# Altium project ESP32_Projet.PrjPcb
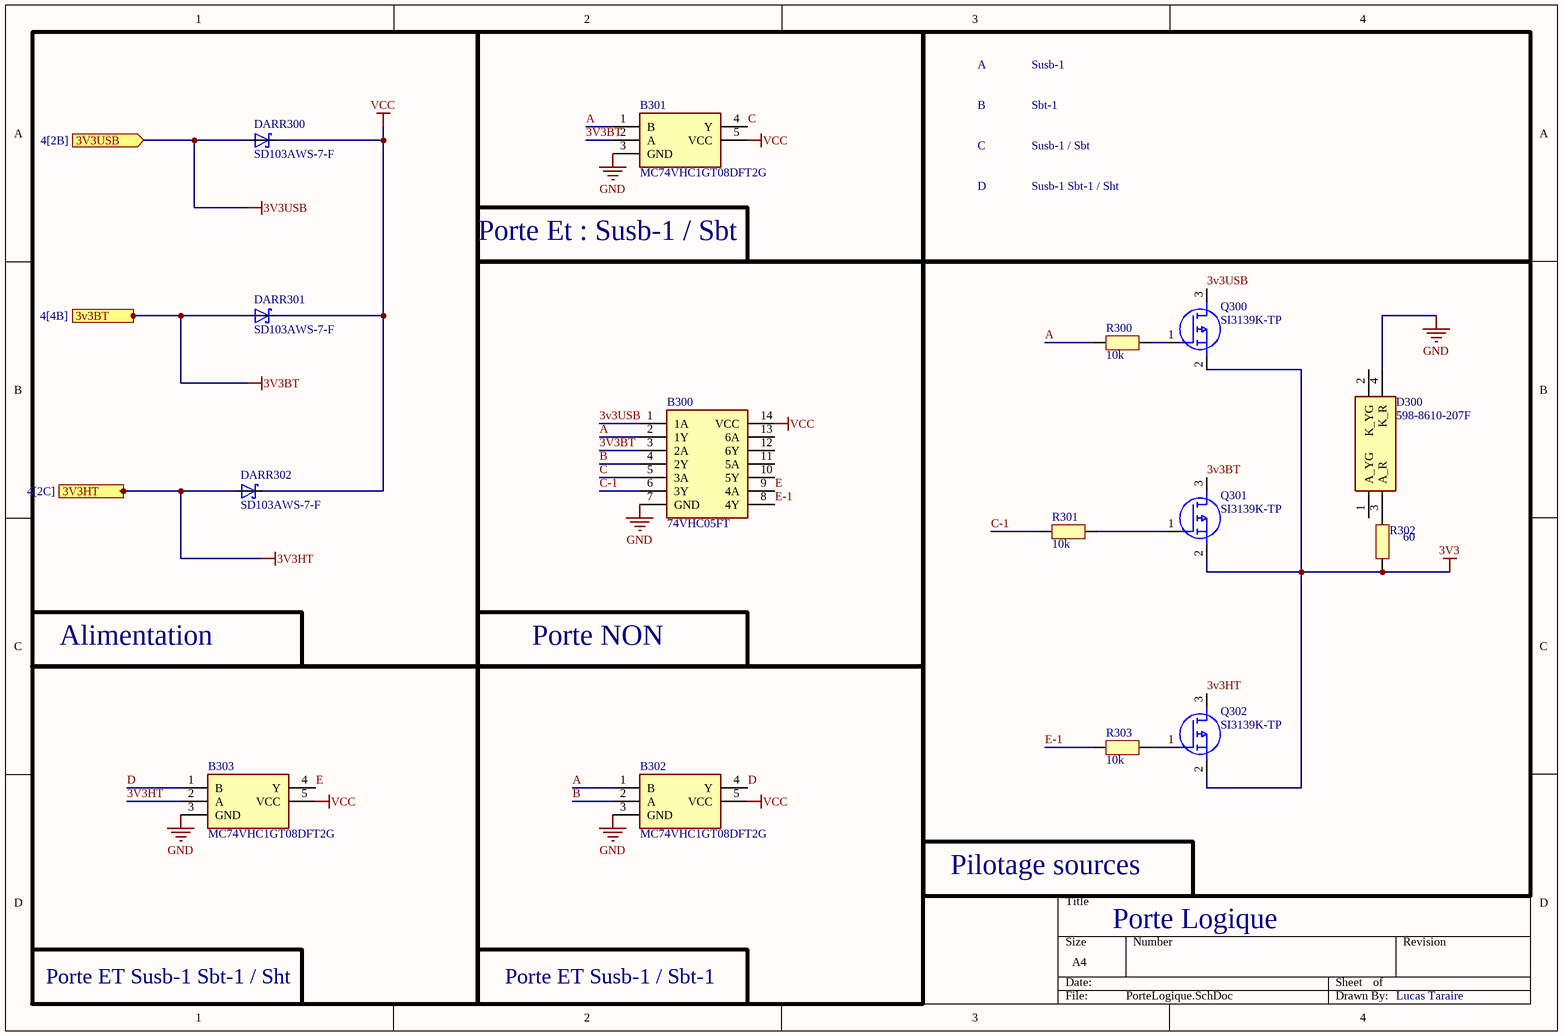
[diagram p0: PorteLogique.SchDoc]
7 sheets, 82 parts. Net scope: flat (ports and power ports of the same name join across sheets).
Board file: PCB1.PcbDoc
Sheets:
  PorteLogique.SchDoc
  IHM.SchDoc
  Extensibilite.SchDoc
  MCU et Communication.SchDoc
  Mesure.SchDoc
  Alimentation.SchDoc
  Sources.SchDoc

## Sheet PorteLogique.SchDoc: Porte Logique
size A4; Date: 25/11/2024; Author: Lucas Taraire; DrawnBy: Lucas Taraire; SheetNumber: 1; SheetTotal: 7

### Parts
B300  74VHC05FT  [SOP65P640X120-14N]
B301  MC74VHC1GT08DFT2G  [SOT65P210X110-5N]
B302  MC74VHC1GT08DFT2G  [SOT65P210X110-5N]
B303  MC74VHC1GT08DFT2G  [SOT65P210X110-5N]
D300  598-8610-207F  [5988610207F]
DARR300  SD103AWS-7-F  [SD103AWS-7-F]
DARR301  SD103AWS-7-F  [SD103AWS-7-F]
DARR302  SD103AWS-7-F  [SD103AWS-7-F]
Q300  SI3139K-TP  [SI3139K-TP]
Q301  SI3139K-TP  [SI3139K-TP]
Q302  SI3139K-TP  [SI3139K-TP]
R300  10k  [RESC1005X06N]
R301  10k  [RESC1005X06N]
R302  60  [RESC1005X06N]
R303  10k  [RESC1005X06N]

### Blocks framed on the sheet
Porte Et : Susb-1 / Sbt: B301
Pilotage sources: D300 Q300-Q302 R300-R303
Alimentation: B303
Porte NON: B302

### Ports
3v3BT (in, see 4[4B]), 3V3HT (in, see 4[2C]), 3V3USB (in, see 4[2B])

### Nets
3V3: Q300.2(S) Q301.2(S) Q302.2(S) R302.1
3V3BT: B300.3(2A) B301.2(A) DARR301.2(A) Q301.3(D) ; port 3v3BT
3V3HT: B303.2(A) DARR302.2(A) Q302.3(D) ; port 3V3HT
3v3USB: B300.1(1A) DARR300.2(A) Q300.3(D) ; port 3V3USB
GND: B300.7(GND) B301.3(GND) B302.3(GND) B303.3(GND) D300.4(K_R)
VCC: B300.14(VCC) B301.5(VCC) B302.5(VCC) B303.5(VCC) DARR300.1(C) DARR301.1(C) DARR302.1(C)
A: B300.2(1Y) B301.1(B) B302.1(B) R300.1
B: B300.4(2Y) B302.2(A)
C: B300.5(3A) B301.4(Y)
C-1: B300.6(3Y) R301.1
D: B302.4(Y) B303.1(B)
E: B300.9(4A) B303.4(Y)
E-1: B300.8(4Y) R303.1
NetQ300_1: Q300.1(G) R300.2
NetQ301_1: Q301.1(G) R301.2
NetQ302_1: Q302.1(G) R303.2

Not connected (* = marked no-connect by the designer): B300 10(5Y) 11(5A) 12(6Y) 13(6A); D300 1(A_YG) 2(K_YG) 3(A_R); R302 2

### Notes on the sheet
- A
- B
- Susb-1
- Sbt-1
- C
- Susb-1 / Sbt
- D
- Susb-1 Sbt-1 / Sht
- Porte ET Susb-1 Sbt-1 / Sht
- Porte ET Susb-1 / Sbt-1

### Library data of the parts
B300 = 74VHC05FT: Logic Gates CMOS LOGIC IC INVERTER; Manufacturer_Name: Toshiba; Manufacturer_Part_Number: 74VHC05FT; Mouser Part Number: 757-74VHC05FT
B301-B303 = MC74VHC1GT08DFT2G: Single 2-Input AND Gate, TTL Level; Manufacturer_Name: onsemi; Manufacturer_Part_Number: MC74VHC1GT08DFT2G; Parameter 3: *
D300 = 598-8610-207F: Standard LEDs - SMD Red/Green WC 80/50mcd 645/570nm; Manufacturer_Name: Dialight; Geometry.Height: 0.8mm; Manufacturer_Part_Number: 598-8610-207F; Mouser Part Number: 645-598-8610-207F; Mouser Price/Stock: https://www.mouser.co.uk/ProductDetail/Dialight/598-8610-207F?qs=7JStj%2FjQ2SFuCjosqwklHQ%3D%3D; Arrow Part Number: 598-8610-207F; Arrow Price/Stock: https://www.arrow.com/en/products/598-8610-207f/dialight?region=nac; Datasheet Link: https://media.digikey.com/pdf/Data%20Sheets/Dialight%20PDFs/598%20Series%201210%20Pkg%20Bi-Color.pdf
DARR300-DARR302 = SD103AWS-7-F: Diode Array 3 Independent Schottky 40V 175mA Surface Mount 6-TSSOP, SC-88, SOT-363
Q300-Q302 = SI3139K-TP: MOSFET P-Channel MOSFET
R300-R303 = Resistor

## Sheet IHM.SchDoc
size A4; SheetNumber: 2; SheetTotal: 7
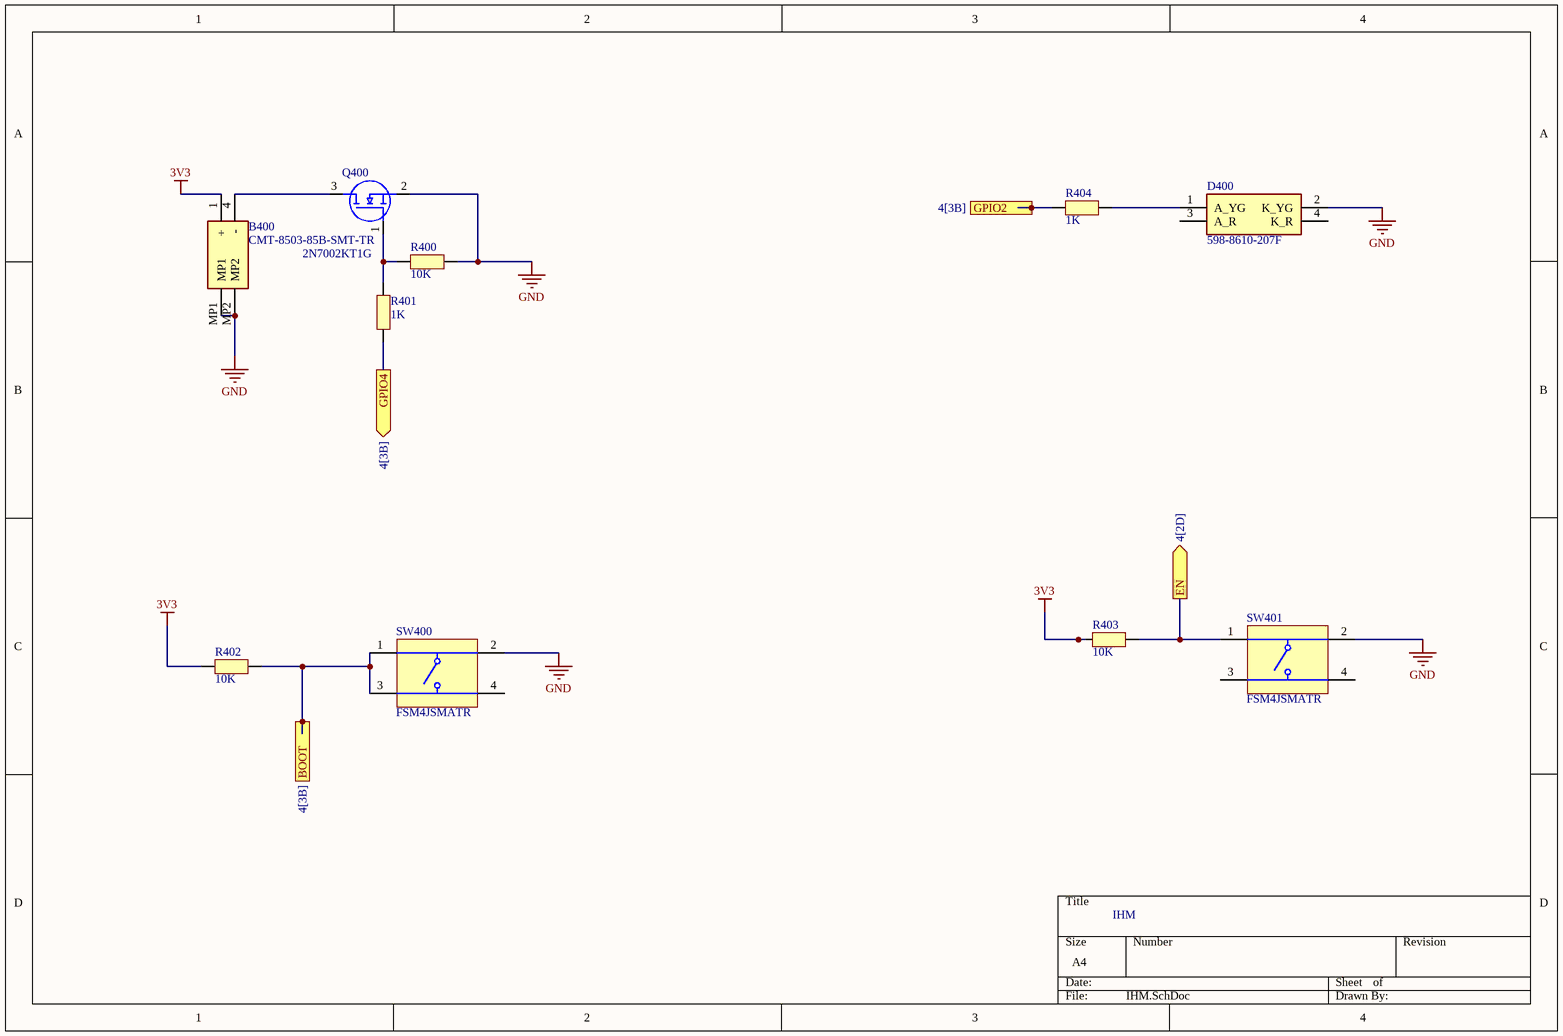
[diagram p1: IHM.SchDoc]

### Parts
B400  CMT-8503-85B-SMT-TR  [CMT850385BSMTTR]
D400  598-8610-207F  [5988610207F]
Q400  2N7002KT1G  [SOT96P237X111-3N]
R400  10K  [RESC1005X06N]
R401  1K  [RESC1005X06N]
R402  10K  [RESC1005X06N]
R403  10K  [RESC1005X06N]
R404  1K  [RESC1005X06N]
SW400  FSM4JSMATR  [TECO-FSM4JSMATR_V]
SW401  FSM4JSMATR  [TECO-FSM4JSMATR_V]

### Ports
BOOT (out, see 4[3B]), EN (out, see 4[2D]), GPIO2 (in, see 4[3B]), GPIO4 (out, see 4[3B])

### Nets
3V3: B400.1(+) R402.2 R403.2
GND: B400.MP1 B400.MP2 D400.2(K_YG) Q400.2(S) R400.2 SW400.2 SW401.2
NetB400_4: B400.4(-) Q400.3(D)
NetD400_1: D400.1(A_YG) R404.1
NetQ400_1: Q400.1(G) R400.1 R401.2
NetR401_1: R401.1 ; port GPIO4
NetR402_1: R402.1 SW400.1 SW400.3 ; port BOOT
NetR403_1: R403.1 SW401.1 ; port EN
NetR404_2: R404.2 ; port GPIO2

Not connected (* = marked no-connect by the designer): D400 3(A_R) 4(K_R); SW400 4; SW401 3 4

### Notes on the sheet
- IHM

### Library data of the parts
B400 = CMT-8503-85B-SMT-TR: Speakers & Transducers buzzer, 8.5 mm, 3 mm deep, M, 3.6 V, 85 dB, Surface Mount (SMT), Audio Transducer; Manufacturer_Name: Same Sky; Manufacturer_Part_Number: CMT-8503-85B-SMT-TR; Mouser Part Number: 490-CMT-850385BSMTTR
D400 = 598-8610-207F: as D300 on sheet PorteLogique; Manufacturer_Part_Number: 598-8610-207F; Mouser Part Number: 645-598-8610-207F; Mouser Price/Stock: https://www.mouser.co.uk/ProductDetail/Dialight/598-8610-207F?qs=7JStj%2FjQ2SFuCjosqwklHQ%3D%3D; Arrow Part Number: 598-8610-207F; Arrow Price/Stock: https://www.arrow.com/en/products/598-8610-207f/dialight?region=nac; Datasheet Link: https://media.digikey.com/pdf/Data%20Sheets/Dialight%20PDFs/598%20Series%201210%20Pkg%20Bi-Color.pdf
Q400 = 2N7002KT1G: MOSFET N-Ch 60V 380mA Small Signal SOT23 ON Semiconductor 2N7002KT1G N-channel MOSFET Transistor, 380 mA, 60 V, 3-Pin SOT-23; Manufacturer_Name: onsemi; Geometry.Height: 1.11mm; Manufacturer_Part_Number: 2N7002KT1G; Mouser Part Number: 863-2N7002KT1G; Mouser Price/Stock: https://www.mouser.co.uk/ProductDetail/onsemi/2N7002KT1G?qs=Jh7l0IbPjifUiTytu%252BGGDQ%3D%3D; Arrow Part Number: 2N7002KT1G; Arrow Price/Stock: https://www.arrow.com/en/products/2n7002kt1g/on-semiconductor?utm_currency=USD&region=nac; Datasheet Link: http://www.onsemi.com/pub/Collateral/2N7002K-D.PDF
R400-R404 = Resistor
SW400 SW401 = CMP-2000-07486-1: Micro Miniature Push Button Switch FSM JSM, 50 mA, -35 to 85 degC, 4-Pin SMD, RoHS, Tape and Reel; Manufacturer: TE Connectivity; Mechanical Life: 100000Cycles; Current Rating: 50mA; Actuator Material: Polyamide; Max Voltage Rating (DC): 12V; Capacitance: 0f; Illumination Type: Illuminated; Voltage Rating (DC): 24V; Case\/Package: SMD/SMT; Operating Force: 160gf; Contact Resistance: 100mOhm; Actuator Length: 0.055inch; Switch Travel: 0.25mm; Throw Configuration: SPST; Termination: GullWing; Contact Plating: Silver; Orientation: Straight; Mounting Technology: SurfaceMount; REACH SVHC: Unknown; Electrical Life: 100000Cycles; Package Reference: FSM4JSMATR; Max Operating Temperature: 85degC; Manufacturer URL: http://www.te.com/; Package Description: 4-Pin Surface Mount Device, Body 6 x 6 mm, Pitch 4.5 mm; Datasheet Version: Rev. V, 02/2015; Packaging: TapeandReel; Min Operating Temperature: -35degC; Mount: SurfaceMount; Contact Current Rating: 50mA; Contact Material: CopperAlloy; Package Quantity: 1200; Datasheet URL: http://www.te.com/commerce/DocumentDelivery/DDEController?Action=showdoc&DocId=Customer+Drawing%7F2-1437565-7%7FV%7Fpdf%7FEnglish%7FENG_CD_2-1437565-7_V.pdf%7F4-1437565-2; RoHSCompliant: true

## Sheet Extensibilite.SchDoc: EXTENSIBILITE
size A4; Date: 28/11/2024; Author: NOUBIGA Thierry; SheetNumber: 3; SheetTotal: 7; Time: 14h33
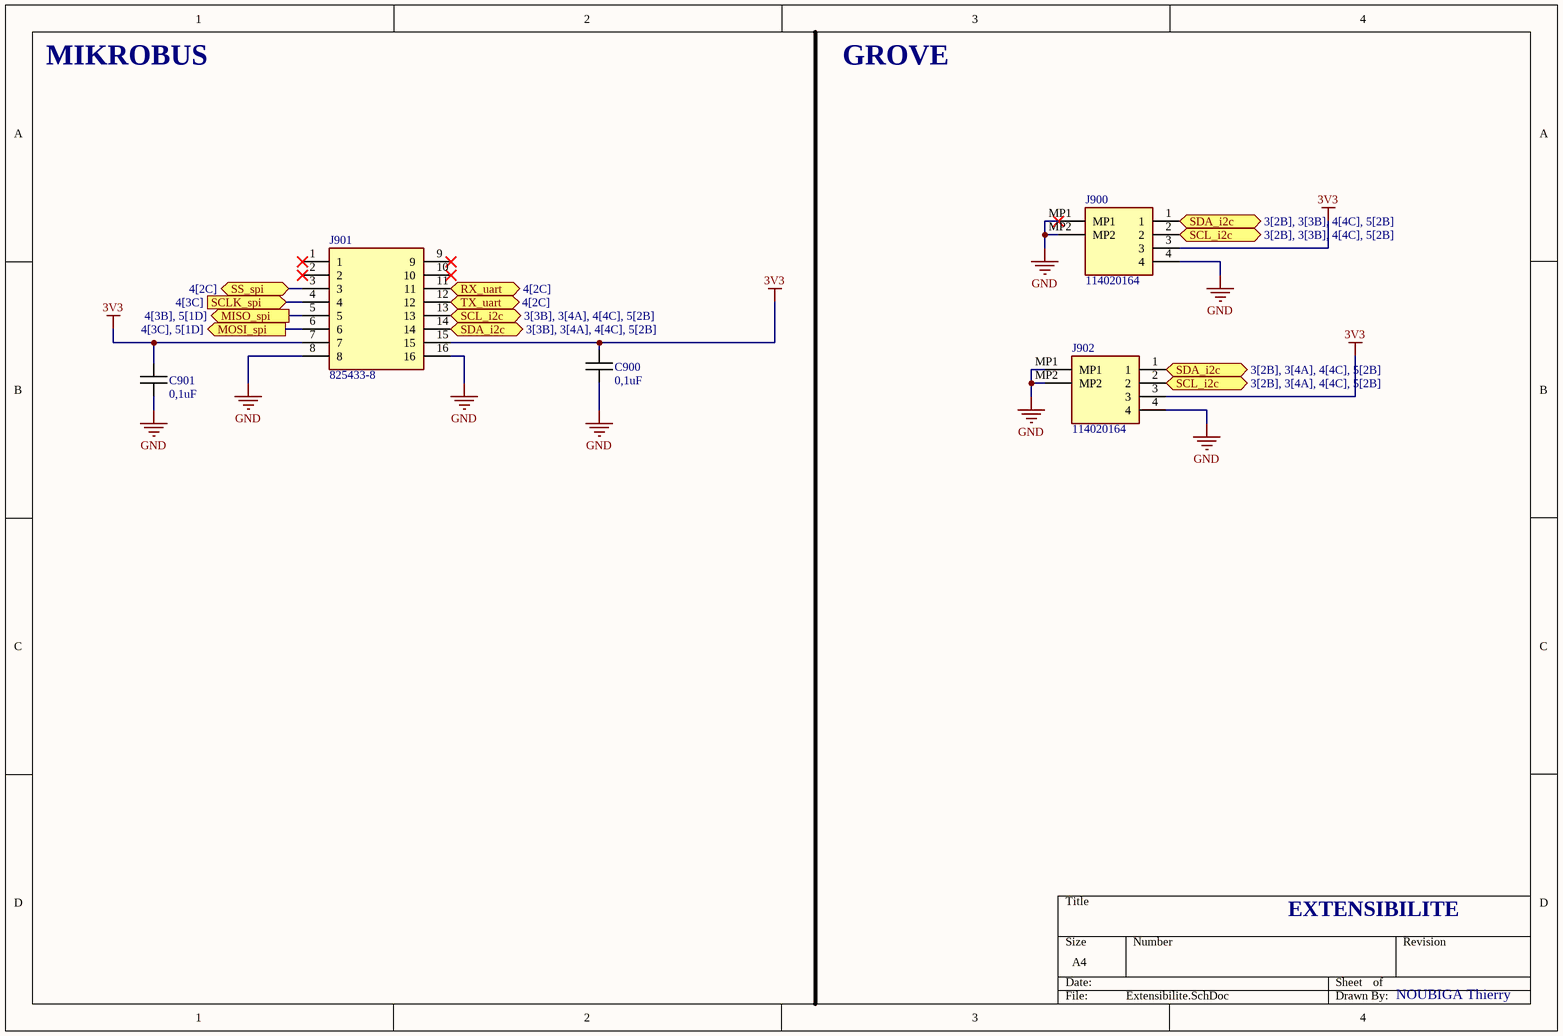
[diagram p2: Extensibilite.SchDoc]

### Parts
C900  0,1uF  [CAPC1005X06N]
C901  0,1uF  [CAPC1005X06N]
J900  114020164  [114020164]
J901  825433-8  [Connect-Mikronus]
J902  114020164  [114020164]

### Ports
MISO_spi (out, see 4[3B], 5[1D]), MOSI_spi (out, see 4[3C], 5[1D]), RX_uart (bidir, see 4[2C]), SCL_i2c (bidir, see 3[2B], 3[3B], 4[4C], 5[2B]), SCL_i2c (bidir, see 3[2B], 3[4A], 4[4C], 5[2B]), SCL_i2c (bidir, see 3[3B], 3[4A], 4[4C], 5[2B]), SCLK_spi (in, see 4[3C]), SDA_i2c (bidir, see 3[2B], 3[3B], 4[4C], 5[2B]), SDA_i2c (bidir, see 3[2B], 3[4A], 4[4C], 5[2B]), SDA_i2c (bidir, see 3[3B], 3[4A], 4[4C], 5[2B]), SS_spi (bidir, see 4[2C]), TX_uart (bidir, see 4[2C])

### Nets
3V3: C900.1 C901.1 J900.3 J901.7 J901.15 J902.3
GND: C900.2 C901.2 J900.4 J900.MP1 J900.MP2 J901.8 J901.16 J902.4 J902.MP1 J902.MP2
NetB500_4: J900.1 J901.14 J902.1 ; port SDA_i2c
NetB500_5: J900.2 J901.13 J902.2 ; port SCL_i2c
NetB501_3: J901.5 ; port MISO_spi
NetJ901_3: J901.3 ; port SS_spi
NetJ901_4: J901.4 ; port SCLK_spi
NetJ901_6: J901.6 ; port MOSI_spi
NetJ901_11: J901.11 ; port RX_uart
NetJ901_12: J901.12 ; port TX_uart

Not connected (* = marked no-connect by the designer): J901 1* 2* 9* 10*

### Notes on the sheet
- MIKROBUS
- GROVE
- EXTENSIBILITE
- NOUBIGA Thierry

### Library data of the parts
C900 C901 = Capacitor
J900 J902 = 114020164: Seeed Studio Accessories Grove Female Header - SMD-4P-2.0mm-90D-20Pcs; Manufacturer_Name: Seeed Studio; Manufacturer_Part_Number: 114020164; Mouser Part Number: 713-114020164
J901 = Connect-Mikronus: Headers & Wire Housings 8P double for connection mikrobus; Manufacturer_Name: TE Connectivity; Manufacturer_Part_Number: 825433-8; Mouser Part Number: 571-825433-8

## Sheet MCU et Communication.SchDoc: COMMUNICATION BLUETOOTH ET MCU
size A4; Date: 28/11/2024; DrawnBy: NOUBIGA Thierry; DocumentNumber: 1; Revision: V1.0 Rev A; SheetNumber: 4; SheetTotal: 7; Time: 14H55
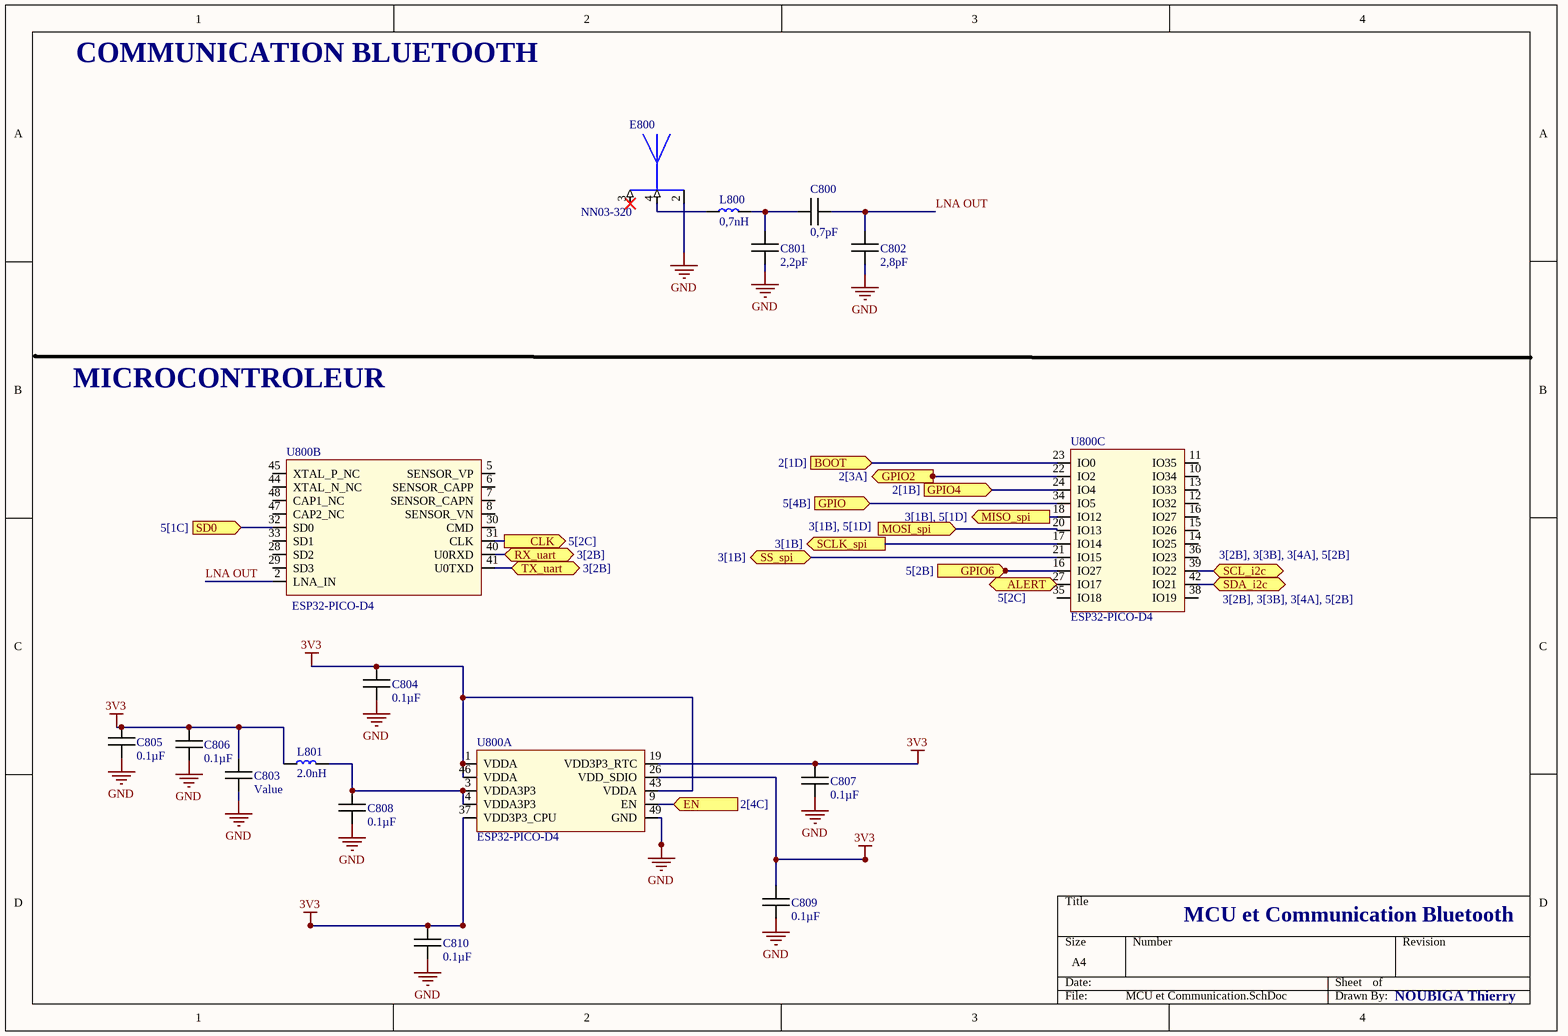
[diagram p3: MCU et Communication.SchDoc]

### Parts
C800  0,7pF  [CAPC1005X06N]
C801  2,2pF  [CAPC1005X06N]
C802  2,8pF  [CAPC1005X06N]
C803  Value  [CAPC1005X06N]
C804  0.1µF  [CAPC1005X06N]
C805  0.1µF  [CAPC1005X06N]
C806  0.1µF  [CAPC1005X06N]
C807  0.1µF  [CAPC1005X06N]
C808  0.1µF  [CAPC1005X06N]
C809  0.1µF  [CAPC1005X06N]
C810  0.1µF  [CAPC1005X06N]
E800  NN03-320  [XCVR_NN03-320]
L800  0,7nH  [LQPC1005X06N]
L801  2.0nH  [LQPC1005X06N]
U800  ESP32-PICO-D4  [PQFN50P700X700X104_HS-49N]  (parts A,B,C of 3)

### Ports
ALERT (bidir, see 5[2C]), BOOT (in, see 2[1D]), CLK (out, see 5[2C]), EN (in, see 2[4C]), GPIO2 (out, see 2[3A]), GPIO4 (in, see 2[1B]), GPIO6 (in, see 5[2B]), GPIO (in, see 5[4B]), MISO_spi (out, see 3[1B], 5[1D]), MOSI_spi (in, see 3[1B], 5[1D]), RX_uart (bidir, see 3[2B]), SCL_i2c (bidir, see 3[2B], 3[3B], 3[4A], 5[2B]), SCLK_spi (out, see 3[1B]), SD0 (in, see 5[1C]), SDA_i2c (bidir, see 3[2B], 3[3B], 3[4A], 5[2B]), SS_spi (bidir, see 3[1B]), TX_uart (bidir, see 3[2B])

### Nets
3V3: C803.1 C804.2 C805.2 C806.2 C807.1 C809.2 C810.1 L801.1 U800.1(VDDA) U800.19(VDD3P3_RTC) U800.26(VDD_SDIO) U800.37(VDD3P3_CPU) U800.43(VDDA) U800.46(VDDA)
GND: C801.2 C802.2 C803.2 C804.1 C805.1 C806.1 C807.2 C808.1 C809.1 C810.2 E800.2(GROUND) U800.49(GND)
LNA OUT: C800.2 C802.1 U800.2(LNA_IN)
NetB500_3: U800.16(IO27) ; port GPIO6
NetB500_4: U800.42(IO21) ; port SDA_i2c
NetB500_5: U800.39(IO22) ; port SCL_i2c
NetB501_1: U800.32(SD0) ; port SD0
NetB501_3: U800.18(IO12) ; port MISO_spi
NetB501_4: U800.31(CLK) ; port CLK
NetB501_5: U800.27(IO17) ; port ALERT
NetB502_2: U800.34(IO5) ; port GPIO
NetC800_1: C800.1 C801.1 L800.2
NetC808_2: C808.2 L801.2 U800.3(VDDA3P3) U800.4(VDDA3P3)
NetE800_4: E800.4(FEED_GNSS) L800.1
NetJ901_3: U800.21(IO15) ; port SS_spi
NetJ901_4: U800.17(IO14) ; port SCLK_spi
NetJ901_6: U800.20(IO13) ; port MOSI_spi
NetJ901_11: U800.40(U0RXD) ; port RX_uart
NetJ901_12: U800.41(U0TXD) ; port TX_uart
NetR401_1: U800.24(IO4) ; port GPIO4
NetR402_1: U800.23(IO0) ; port BOOT
NetR403_1: U800.9(EN) ; port EN
NetR404_2: U800.22(IO2) ; port GPIO2

Not connected (* = marked no-connect by the designer): E800 3(FEED_BLUETOOTH)*; U800 5(SENSOR_VP) 6(SENSOR_CAPP) 7(SENSOR_CAPN) 8(SENSOR_VN) 10(IO34) 11(IO35) 12(IO32) 13(IO33) 14(IO25) 15(IO26) 28(SD2) 29(SD3) 30(CMD) 33(SD1) 35(IO18) 36(IO23) 38(IO19) 44(XTAL_N_NC) 45(XTAL_P_NC) 47(CAP2_NC) 48(CAP1_NC)

### Notes on the sheet
- COMMUNICATION BLUETOOTH
- MICROCONTROLEUR
- MCU et Communication Bluetooth
- NOUBIGA Thierry

### Library data of the parts
C800-C810 = Capacitor
E800 = NN03-320: Dual port antenna booster for GNSS, Bluetooth, 5G and UWB (1561 - 1606MHz, 2400 - 2500MHz, 3400 - 3800MHz, 3100 - 4800MHz and 6000 - 10600 MHz), signal booster; Manufacturer_Name: Ignion; Manufacturer_Part_Number: NN03-320; Mouser Part Number: 128-NN03-320
L800 L801 = Bobine
U800 = ESP32: Système RF sur puce - SoC SIP module ESP32 with 4MByte Flash, Dual Core MCU, Wi-Fi & Bluetooth Combo, LGA48-pin, 7*7mm; Manufacturer 1: Espressif Systems; Supplier 1: Digi-Key; Supplier Part Number 1: 1904-1029-1-ND; Manufacturer Part Number 1: ESP32-PICO-D4

## Sheet Mesure.SchDoc
size A4; SheetNumber: 5; SheetTotal: 7
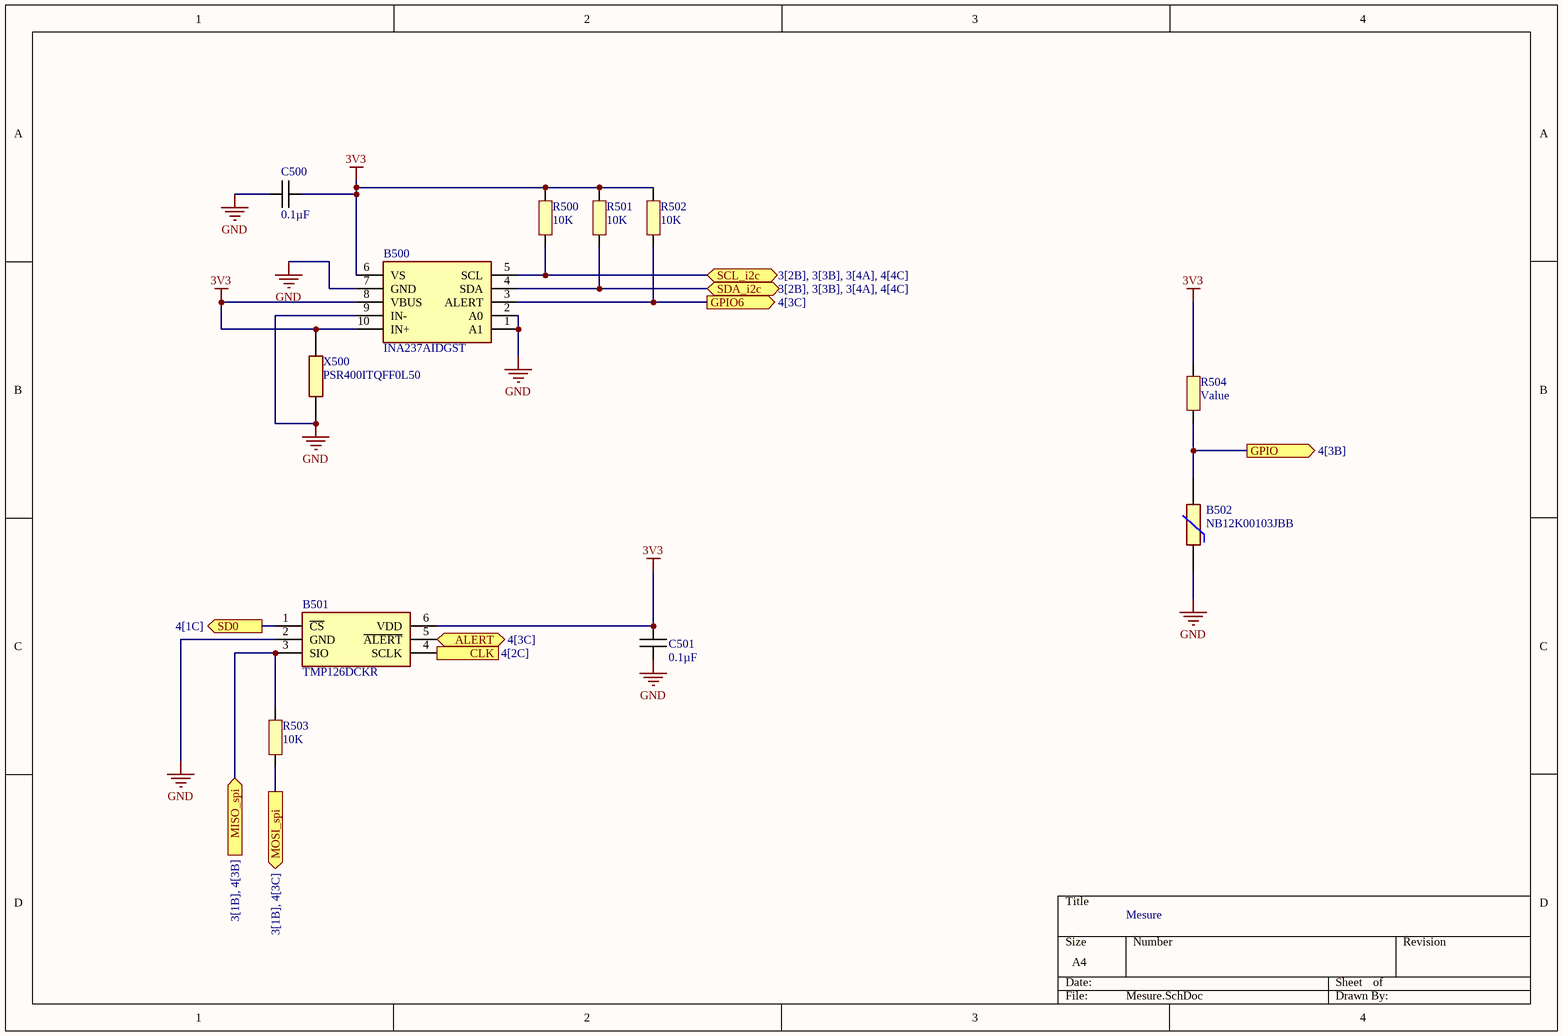
[diagram p4: Mesure.SchDoc]

### Parts
B500  INA237AIDGST  [SOP50P490X110-10N]
B501  TMP126DCKR  [SOT65P210X110-6N]
B502  NB12K00103JBB  [RESC2212X50N]
C500  0.1µF  [CAPC1005X06N]
C501  0.1µF  [CAPC1005X06N]
R500  10K  [RESC1005X06N]
R501  10K  [RESC1005X06N]
R502  10K  [RESC1005X06N]
R503  10K  [RESC1005X06N]
R504  Value  [RESC1005X06N]
X500  PSR400ITQFF0L50  [RESC10052X200N]

### Ports
ALERT (bidir, see 4[3C]), CLK (in, see 4[2C]), GPIO6 (out, see 4[3C]), GPIO (out, see 4[3B]), MISO_spi (in, see 3[1B], 4[3B]), MOSI_spi (out, see 3[1B], 4[3C]), SCL_i2c (bidir, see 3[2B], 3[3B], 3[4A], 4[4C]), SD0 (out, see 4[1C]), SDA_i2c (bidir, see 3[2B], 3[3B], 3[4A], 4[4C])

### Nets
3V3: B500.6(VS) B500.8(VBUS) B500.10(IN+) B501.6(VDD) C500.2 C501.2 R500.2 R501.2 R502.2 R504.1 X500.2
GND: B500.1(A1) B500.2(A0) B500.7(GND) B500.9(IN-) B501.2(GND) B502.1 C500.1 C501.1 X500.1
NetB500_3: B500.3(ALERT) R502.1 ; port GPIO6
NetB500_4: B500.4(SDA) R501.1 ; port SDA_i2c
NetB500_5: B500.5(SCL) R500.1 ; port SCL_i2c
NetB501_1: B501.1(~{CS}) ; port SD0
NetB501_3: B501.3(SIO) R503.1 ; port MISO_spi
NetB501_4: B501.4(SCLK) ; port CLK
NetB501_5: B501.5(~{ALERT}) ; port ALERT
NetB502_2: B502.2 R504.2 ; port GPIO
NetJ901_6: R503.2 ; port MOSI_spi

### Notes on the sheet
- Mesure

### Library data of the parts
B500 = INA237AIDGST: Current Sense Amplifiers 85-V, 16-bit, I2C output current/voltage/power monitor with alert 10-VSSOP -40 to 125; Manufacturer_Name: Texas Instruments; Manufacturer_Part_Number: INA237AIDGST; Mouser Part Number: 595-INA237AIDGST
B501 = TMP126DCKR: Board Mount Temperature Sensors +/-0.25 C SPI temperature sensor with 175 C operation, CRC and slew-rate alert; Manufacturer_Name: Texas Instruments; Manufacturer_Part_Number: TMP126DCKR; Mouser Part Number: 595-TMP126DCKR
B502 = NB12K00103JBB: NTC SMD Thermistor, NB12K, 10K, 5% AVX 10k 0805 Protection NTC Thermistor, 5s, 2 x 1.25 x 1.3mm; Manufacturer_Name: Kyocera AVX; Geometry.Height: 0.5mm; Manufacturer_Part_Number: NB12K00103JBB; Mouser Part Number: 581-NB12K00103JBB; Mouser Price/Stock: https://www.mouser.co.uk/ProductDetail/AVX/NB12K00103JBB/?qs=4%252B6%252BTdINQeDPvI%252BQUQjJ3Q%3D%3D; Arrow Part Number: NB12K00103JBB; Arrow Price/Stock: https://www.arrow.com/en/products/nb12k00103jbb/avx; Datasheet Link: https://datasheet.datasheetarchive.com/originals/distributors/Datasheets-DGA6/551314.pdf
C500 C501 = Capacitor
R500-R504 = Resistor
X500 = PSR400ITQFF0L50: ROHM - PSR400ITQFF0L50 - SMD Current Sense Resistor, 500 ohm, PSR Series, 3921 [1052 Metric], 4 W, +/- 1%, Metal Strip; Manufacturer_Name: ROHM Semiconductor; Geometry.Height: 2mm; Manufacturer_Part_Number: PSR400ITQFF0L50; Mouser Part Number: 755-PSR400ITQFF0L50; Mouser Price/Stock: https://www.mouser.co.uk/ProductDetail/ROHM-Semiconductor/PSR400ITQFF0L50?qs=493kPxzlxfLaT1w5Mo%252BtHg%3D%3D; Arrow Part Number: *; Arrow Price/Stock: *; Datasheet Link: https://componentsearchengine.com/Datasheets/2/PSR400ITQFF0L50.pdf

## Sheet Alimentation.SchDoc
size A4; SheetNumber: 4; SheetTotal: 7
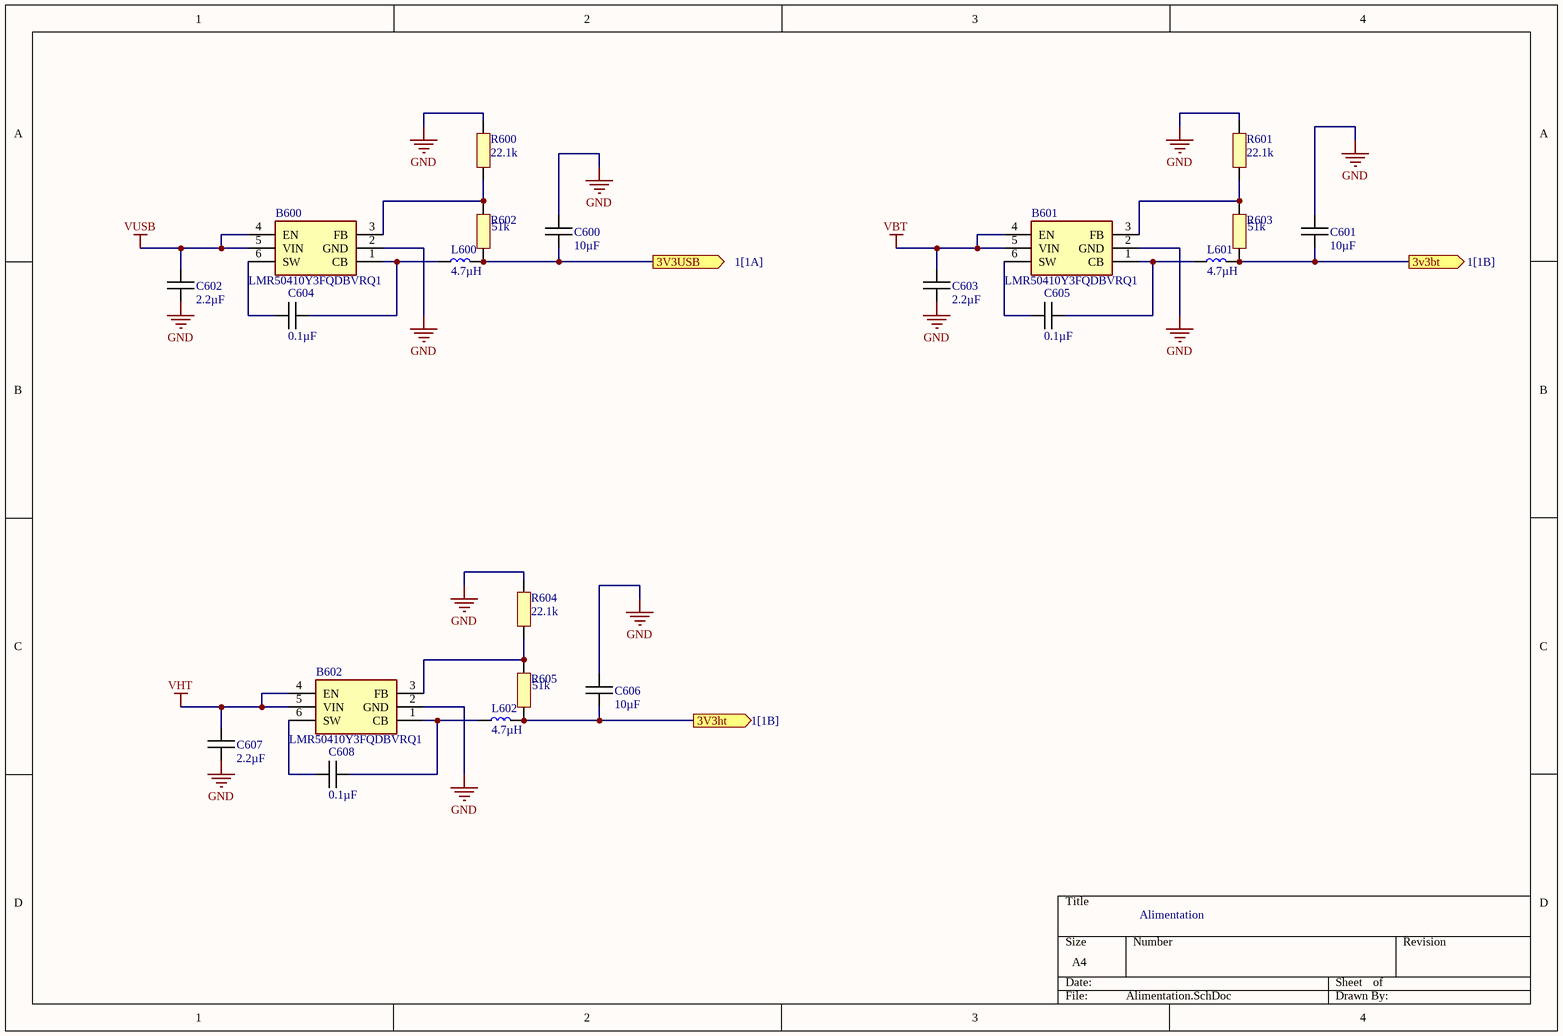
[diagram p5: Alimentation.SchDoc]

### Parts
B600  LMR50410Y3FQDBVRQ1  [SOT95P280X145-6N]
B601  LMR50410Y3FQDBVRQ1  [SOT95P280X145-6N]
B602  LMR50410Y3FQDBVRQ1  [SOT95P280X145-6N]
C600  10µF  [CAPC1005X06N]
C601  10µF  [CAPC1005X06N]
C602  2.2µF  [CAPC1005X06N]
C603  2.2µF  [CAPC1005X06N]
C604  0.1µF  [CAPC1005X06N]
C605  0.1µF  [CAPC1005X06N]
C606  10µF  [CAPC1005X06N]
C607  2.2µF  [CAPC1005X06N]
C608  0.1µF  [CAPC1005X06N]
L600  4.7µH  [LQPC1005X06N]
L601  4.7µH  [LQPC1005X06N]
L602  4.7µH  [LQPC1005X06N]
R600  22.1k  [RESC1005X06N]
R601  22.1k  [RESC1005X06N]
R602  51k  [RESC1005X06N]
R603  51k  [RESC1005X06N]
R604  22.1k  [RESC1005X06N]
R605  51k  [RESC1005X06N]

### Ports
3v3bt (out, see 1[1B]), 3V3ht (out, see 1[1B]), 3V3USB (out, see 1[1A])

### Nets
3V3BT: C601.2 L601.2 R603.1 ; port 3v3bt
3V3HT: C606.2 L602.2 R605.1 ; port 3V3ht
3v3USB: C600.2 L600.2 R602.1 ; port 3V3USB
GND: B600.2(GND) B601.2(GND) B602.2(GND) C600.1 C601.1 C602.2 C603.2 C606.1 C607.2 R600.2 R601.2 R604.2
VBT: B601.4(EN) B601.5(VIN) C603.1
VHT: B602.4(EN) B602.5(VIN) C607.1
VUSB: B600.4(EN) B600.5(VIN) C602.1
NetB600_1: B600.1(CB) C604.1 L600.1
NetB600_3: B600.3(FB) R600.1 R602.2
NetB600_6: B600.6(SW) C604.2
NetB601_1: B601.1(CB) C605.1 L601.1
NetB601_3: B601.3(FB) R601.1 R603.2
NetB601_6: B601.6(SW) C605.2
NetB602_1: B602.1(CB) C608.1 L602.1
NetB602_3: B602.3(FB) R604.1 R605.2
NetB602_6: B602.6(SW) C608.2

### Notes on the sheet
- Alimentation

### Library data of the parts
B600-B602 = LMR50410Y3FQDBVRQ1: Régulateurs de tension de commutation Automotive qualified SIMPLE SWITCHER 4-V to 36-V, 1-A synchronous step-down converter 6-SOT-23 -40 to 150; Manufacturer_Name: Texas Instruments; Manufacturer_Part_Number: LMR50410Y3FQDBVRQ1; Mouser Part Number: 595-R50410Y3FQDBVRQ1
C600-C608 = Capacitor
L600-L602 = Bobine
R600-R605 = Resistor

## Sheet Sources.SchDoc
size A4; SheetNumber: 7; SheetTotal: 7
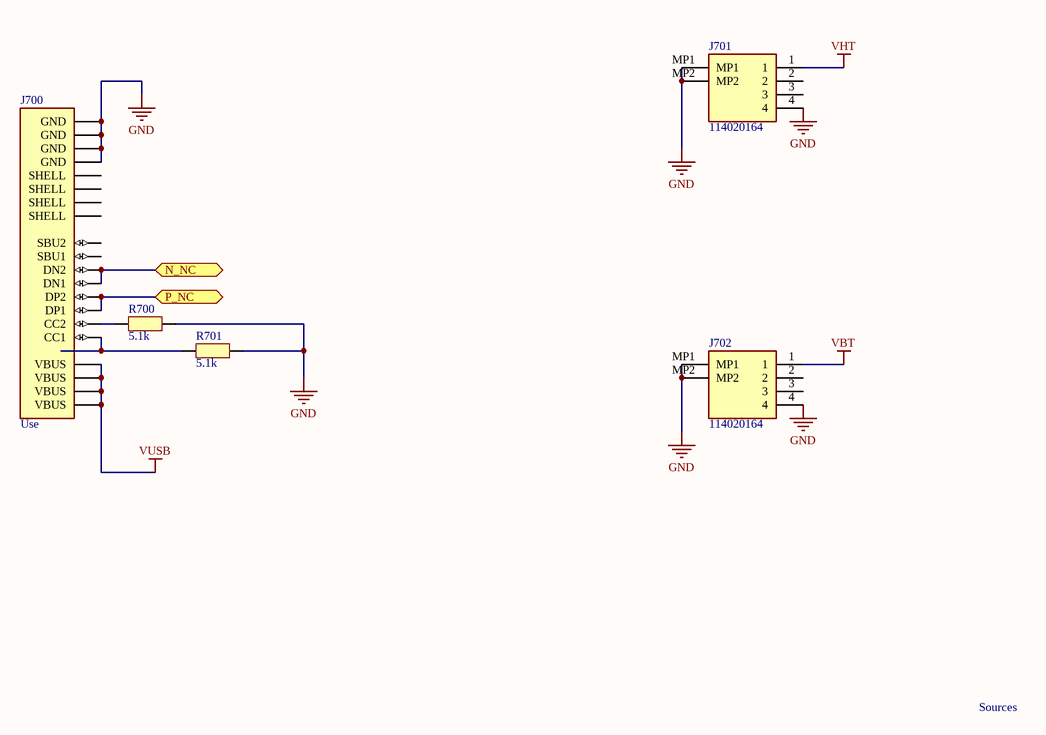
[diagram p6: Sources.SchDoc]

### Parts
J700  Use  [USB4085-GF-A]
J701  114020164  [114020164]
J702  114020164  [114020164]
R700  5.1k  [RESC1005X06N]
R701  5.1k  [RESC1005X06N]

### Ports
N_NC (bidir), P_NC (bidir)

### Nets
GND: J700.A1(GND) J700.A12(GND) J700.B1(GND) J700.B12(GND) J701.4 J701.MP1 J701.MP2 J702.4 J702.MP1 J702.MP2 R700.2 R701.2
VBT: J702.1
VHT: J701.1
VUSB: J700.A4(VBUS) J700.A9(VBUS) J700.B4(VBUS) J700.B9(VBUS)
NetJ700_A5: J700.A5(CC1) R701.1
NetJ700_A6: J700.A6(DP1) J700.B6(DP2) ; port P_NC
NetJ700_A7: J700.A7(DN1) J700.B7(DN2) ; port N_NC
NetJ700_B5: J700.B5(CC2) R700.1

Not connected (* = marked no-connect by the designer): J700 A8(SBU1) B8(SBU2) S1(SHELL) S2(SHELL) S3(SHELL) S4(SHELL); J701 2 3; J702 2 3

### Notes on the sheet
- Sources

### Library data of the parts
J700 = USB4085-GF-A: Connecteurs USB USB Type C, 2.0, Rec, TH , G/F, RA , Top Mnt, T & R
J701 J702 = 114020164: as J900 on sheet Extensibilite; Manufacturer_Name: Seeed Studio; Manufacturer_Part_Number: 114020164; Mouser Part Number: 713-114020164
R700 R701 = Resistor

## Nets that join several sheets
3V3: PorteLogique (Q300.2 Q301.2 Q302.2 R302.1), IHM (B400.1 R402.2 R403.2), Extensibilite (6 pins), MCU et Communication (14 pins), Mesure (11 pins)
3V3BT: PorteLogique (B300.3 B301.2 DARR301.2 Q301.3), Alimentation (C601.2 L601.2 R603.1)
3V3HT: PorteLogique (B303.2 DARR302.2 Q302.3), Alimentation (C606.2 L602.2 R605.1)
3v3USB: PorteLogique (B300.1 DARR300.2 Q300.3), Alimentation (C600.2 L600.2 R602.1)
GND: PorteLogique (5 pins), IHM (7 pins), Extensibilite (10 pins), MCU et Communication (12 pins), Mesure (9 pins), Alimentation (12 pins), Sources (12 pins)
VBT: Alimentation (B601.4 B601.5 C603.1), Sources (J702.1)
VHT: Alimentation (B602.4 B602.5 C607.1), Sources (J701.1)
VUSB: Alimentation (B600.4 B600.5 C602.1), Sources (J700.A4 J700.A9 J700.B4 J700.B9)
NetB500_3: MCU et Communication (U800.16), Mesure (B500.3 R502.1)
NetB500_4: Extensibilite (J900.1 J901.14 J902.1), MCU et Communication (U800.42), Mesure (B500.4 R501.1)
NetB500_5: Extensibilite (J900.2 J901.13 J902.2), MCU et Communication (U800.39), Mesure (B500.5 R500.1)
NetB501_1: MCU et Communication (U800.32), Mesure (B501.1)
NetB501_3: Extensibilite (J901.5), MCU et Communication (U800.18), Mesure (B501.3 R503.1)
NetB501_4: MCU et Communication (U800.31), Mesure (B501.4)
NetB501_5: MCU et Communication (U800.27), Mesure (B501.5)
NetB502_2: MCU et Communication (U800.34), Mesure (B502.2 R504.2)
NetJ901_3: Extensibilite (J901.3), MCU et Communication (U800.21)
NetJ901_4: Extensibilite (J901.4), MCU et Communication (U800.17)
NetJ901_6: Extensibilite (J901.6), MCU et Communication (U800.20), Mesure (R503.2)
NetJ901_11: Extensibilite (J901.11), MCU et Communication (U800.40)
NetJ901_12: Extensibilite (J901.12), MCU et Communication (U800.41)
NetR401_1: IHM (R401.1), MCU et Communication (U800.24)
NetR402_1: IHM (R402.1 SW400.1 SW400.3), MCU et Communication (U800.23)
NetR403_1: IHM (R403.1 SW401.1), MCU et Communication (U800.9)
NetR404_2: IHM (R404.2), MCU et Communication (U800.22)